# EAGLE design team4-selo-atmega32u4 (EAGLE 9.5.1)
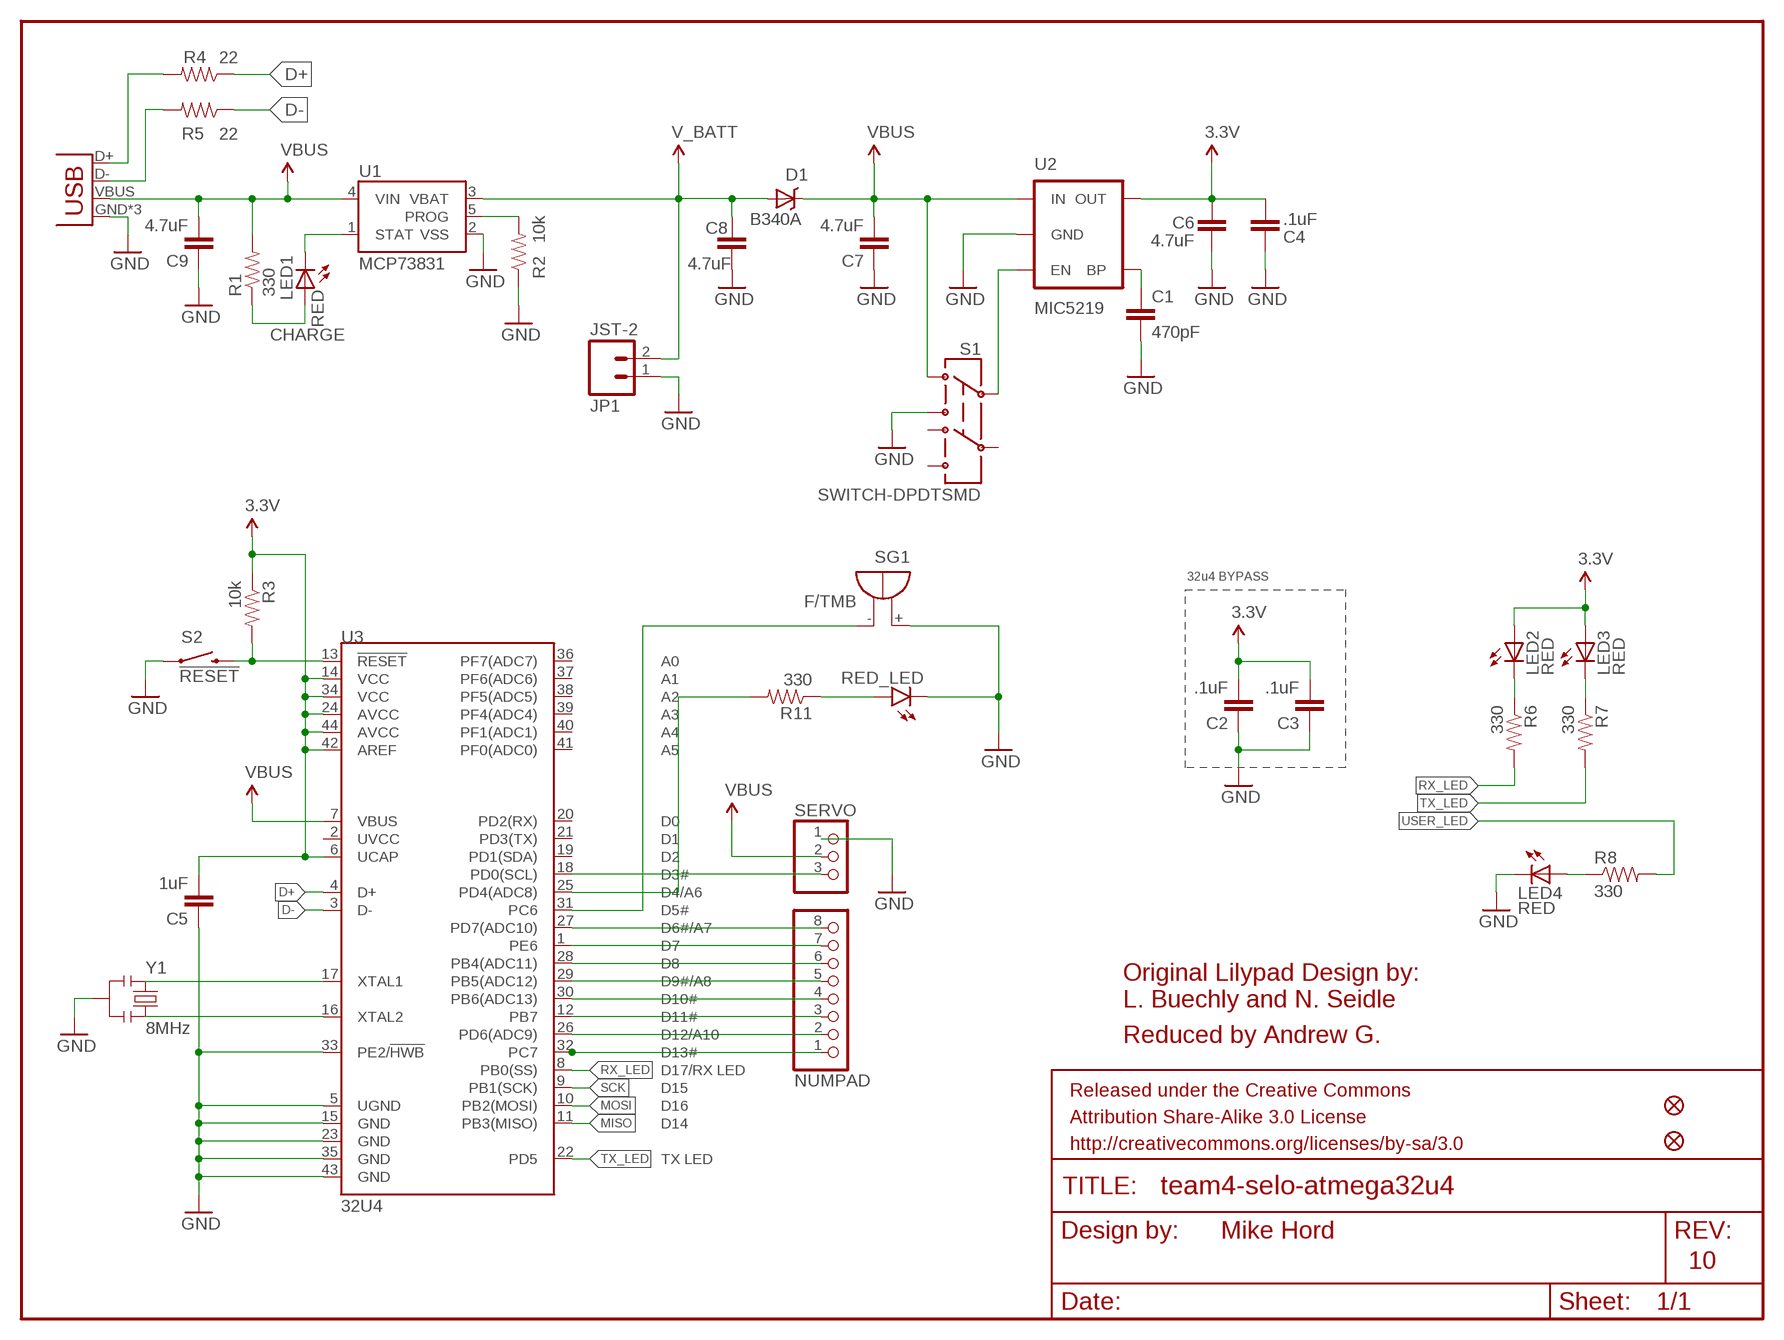
[diagram p0: schematic, sheet 1]

## Parts
C1  470pF  CAP0603-CAP  [0603-CAP]
C2  .1uF  CAP0603-CAP  [0603-CAP]
C3  .1uF  CAP0603-CAP  [0603-CAP]
C4  .1uF  CAP0603-CAP  [0603-CAP]
C5  1uF  CAP0603-CAP  [0603-CAP]
C6  4.7uF  CAP0603-CAP  [0603-CAP]
C7  4.7uF  CAP1206  [1206]
C8  4.7uF  CAP1206  [1206]
C9  4.7uF  CAP1206  [1206]
D1  B340A  DIODE-SCHOTTKY_  [SMA-DIODE]
JP1  JST-2  M02-JST-2MM-SMT  [JST-2-SMD]
JP2  FIDUCIALUFIDUCIAL  [MICRO-FIDUCIAL]
JP3  FIDUCIALUFIDUCIAL  [MICRO-FIDUCIAL]
LED1  RED  LED0603  [LED-0603]
LED2  RED  LED0603  [LED-0603]
LED3  RED  LED0603  [LED-0603]
LED4  RED  LED0603  [LED-0603]
NUMPAD  PINHD-1X8  [1X08]
R1  330  RESISTOR0603-RES  [0603-RES]
R2  10k  RESISTOR0603-RES  [0603-RES]
R3  10k  RESISTOR0603-RES  [0603-RES]
R4  22  RESISTOR0603-RES  [0603-RES]
R5  22  RESISTOR0603-RES  [0603-RES]
R6  330  RESISTOR0603-RES  [0603-RES]
R7  330  RESISTOR0603-RES  [0603-RES]
R8  330  RESISTOR0603-RES  [0603-RES]
R11  330  RESISTOR0603-RES  [0603-RES]
RED_LED  LED5MM  [LED5MM]
S1  SWITCH-DPDTSMD  [AYZ0202]
S2  !RESET  SWITCH-MOMENTARY-2SMD  [TACTILE_SWITCH_SMD]
SERVO  PINHD-1X3  [1X03]
SG1  F/TMB  [F/TMB]
U1  MCP73831  [SOT23-5]
U2  MIC5219  V_REG_MIC5219SMD  [SOT23-5]
U3  32U4  ATMEGA32U4TQFP-44  [TQFP44]
X1  USB-MICROB  [USB-MICROB]
Y1  8MHz  RESONATORSMD  [RESONATOR-SMD]

## Nets
3.3V: C2.2 C3.2 C4.2 C5.2 C6.2 LED2.A LED3.A R3.1 U2.5(OUT) U3.6(UCAP) U3.14(VCC) U3.24(AVCC) U3.34(VCC) U3.42(AREF) U3.44(AVCC)
5V: C7.2 C9.2 D1.C R1.2 S1.1 SERVO.2 U1.4(VIN) U2.1(IN) U3.7(VBUS) X1.VBUS ; supply symbol labelled VBUS
D+: R4.1 U3.4(D+)
D-: R5.1 U3.3(D-)
GND: C1.2 C2.1 C3.1 C4.1 C5.1 C6.1 C7.1 C8.1 C9.1 JP1.1 LED4.C R2.1 RED_LED.K(C) S1.3 S2.1 SERVO.1 SG1.+ U1.2(VSS) U2.2(GND) U3.5(UGND) U3.15(GND) U3.23(GND) U3.33(PE2/!HWB) U3.35(GND) U3.43(GND) X1.GND X1.MT1(GND) X1.MT2(GND) Y1.2
MISO: U3.11(PB3(MISO))
MOSI: U3.10(PB2(MOSI))
N$1: LED2.C R6.1
N$2: S1.2 U2.3(EN)
N$3: LED1.A R1.1
N$4: LED1.C U1.1(STAT)
N$5: U3.17(XTAL1) Y1.1
N$6: R2.2 U1.5(PROG)
N$7: U3.16(XTAL2) Y1.3
N$8: C1.1 U2.4(BP)
N$9: NUMPAD.8 U3.27(PD7(ADC10))
N$10: NUMPAD.7 U3.1(PE6)
N$11: NUMPAD.6 U3.28(PB4(ADC11))
N$12: NUMPAD.5 U3.29(PB5(ADC12))
N$13: NUMPAD.4 U3.30(PB6(ADC13))
N$14: NUMPAD.3 U3.12(PB7)
N$15: NUMPAD.2 U3.26(PD6(ADC9))
N$16: SERVO.3 U3.18(PD0(SCL))
N$17: SG1.- U3.31(PC6)
N$18: LED4.A R8.1
N$19: R5.2 X1.D-
N$20: R4.2 X1.D+
N$21: LED3.C R7.1
N$22: R11.2 U3.25(PD4(ADC8))
N$23: R11.1 RED_LED.A
RESET: R3.2 S2.3 U3.13(!RESET)
RX_LED: R6.2 U3.8(PB0(SS))
SCK: U3.9(PB1(SCK))
TX_LED: R7.2 U3.22(PD5)
USER_LED: NUMPAD.1 R8.2 U3.32(PC7)
V_BATT: C8.2 D1.A JP1.2 U1.3(VBAT)
Unconnected: S1.4 S1.5 S1.6 U3.2(UVCC) U3.19(PD1(SDA)) U3.20(PD2(RX)) U3.21(PD3(TX)) U3.36(PF7(ADC7)) U3.37(PF6(ADC6)) U3.38(PF5(ADC5)) U3.39(PF4(ADC4)) U3.40(PF1(ADC1)) U3.41(PF0(ADC0))

## Notes on the sheet
- CHARGE
- 32u4 BYPASS
- Original Lilypad Design by:
- L. Buechly and N. Seidle
- Reduced by Andrew G.
- Mike Hord
- 10

## Library data of the parts
C1 = SparkFun-Passives:CAP: Capacitor Standard 0603 ceramic capacitor, and 0.1" leaded capacitor.; PROD_ID: CAP-07884
C2-C4 = SparkFun-Passives:CAP: Capacitor Standard 0603 ceramic capacitor, and 0.1" leaded capacitor.; PROD_ID: CAP-00810
C5 = SparkFun-Passives:CAP: Capacitor Standard 0603 ceramic capacitor, and 0.1" leaded capacitor.; PROD_ID: CAP-00868
C6 = SparkFun-Passives:CAP: Capacitor Standard 0603 ceramic capacitor, and 0.1" leaded capacitor.; PROD_ID: CAP-08280
C7-C9 = SparkFun-Passives:CAP: Capacitor Standard 0603 ceramic capacitor, and 0.1" leaded capacitor.; PROD_ID: CAP-10300
D1 = SparkFun-DiscreteSemi:DIODE-SCHOTTKY: Commonly MBRA140.; PROD_ID: DIO-09886
JP1 = SparkFun-Connectors:M02: Header 2 Standard 2-pin 0.1" header. Use with straight break away headers (SKU : PRT-00116), right angle break away headers (PRT-00553), swiss pins (PRT-00743), machine pins (PRT-00117), and female headers (PRT-00115). Molex polarized connector foot print use with SKU : PRT-08233 with associated crimp pins and housings.; PROD_ID: CONN-08352
JP2 JP3 = SparkFun:FIDUCIAL: Fiducial Alignment Points Various fiducial points for machine vision alignment.
LED1-LED4 = SparkFun-LED:LED: LEDs Standard schematic elements and footprints for 5mm, 3mm, 1206, and 0603 sized LEDs. 5mm - Spark Fun Electronics SKU : COM-00529 (and others); PROD_ID: DIO-00819
NUMPAD = pinhead:PINHD-1X8: PIN HEADER
R1 R6-R8 R11 = SparkFun-Passives:RESISTOR: Resistor Basic schematic elements and footprints for 0603, 1206, and PTH resistors.; PROD_ID: RES-00818
R2 R3 = SparkFun-Passives:RESISTOR: Resistor Basic schematic elements and footprints for 0603, 1206, and PTH resistors.; PROD_ID: RES-00824
R4 R5 = SparkFun-Passives:RESISTOR: Resistor Basic schematic elements and footprints for 0603, 1206, and PTH resistors.; PROD_ID: RES-08698
RED_LED = led:LED: LED OSRAM: - CHIPLED LG R971, LG N971, LY N971, LG Q971, LY Q971, LO R971, LY R971 LH N974, LH R974 LS Q976, LO Q976, LY Q976 LO Q996 - Hyper CHIPLED LW Q18S LB Q993, LB Q99A, LB R99A - SideLED LS A670, LO A670, LY A670, LG A670, LP A670 LB A673, LV A673, LT A673, LW A673 LH A674 LY A675 LS A676, LA A676, LO A676, LY A676, LW A676 LS A679, LY A679, LG A679 - Hyper Micro SIDELED® LS Y876, LA Y876, LO Y876, LY Y876 LT Y87S - SmartLED LW L88C, LW L88S LB L89C, LB L89S, LG L890 LS L89K, LO L89K, LY L89K LS L896, LA L896, LO L896, LY L896 - TOPLED LS T670, LO T670, LY T670, LG T670, LP T670 LSG T670, LSP T670, LSY T670, LOP T670, LYG T670 LG T671, LOG T671, LSG T671 LB T673, LV T673, LT T673, LW T673 LH T674 LS T676, LA T676, LO T676, LY T676, LB T676, LH T676, LSB T676, LW T676 LB T67C, LV T67C, LT T67C, LS T67K, LO T67K, LY T67K, LW E67C LS E67B, LA E67B, LO E67B, LY E67B, LB E67C, LV E67C, LT E67C LW T67C LS T679, LY T679, LG T679 LS T770, LO T770, LY T770, LG T770, LP T770 LB T773, LV T773, LT T773, LW T773 LH T774 LS E675, LA E675, LY E675, LS T675 LS T776, LA T776, LO T776, LY T776, LB T776 LHGB T686 LT T68C, LB T68C - Hyper Mini TOPLED® LB M676 - Mini TOPLED Santana® LG M470 LS M47K, LO M47K, LY M47K Source: http://www.osram.convergy.de LUXEON: - LUMILED® LXK2-PW12-R00, LXK2-PW12-S00, LXK2-PW14-U00, LXK2-PW14-V00 LXK2-PM12-R00, LXK2-PM12-S00, LXK2-PM14-U00 LXK2-PE12-Q00, LXK2-PE12-R00, LXK2-PE12-S00, LXK2-PE14-T00, LXK2-PE14-U00 LXK2-PB12-K00, LXK2-PB12-L00, LXK2-PB12-M00, LXK2-PB14-N00, LXK2-PB14-P00, LXK2-PB14-Q00 LXK2-PR12-L00, LXK2-PR12-M00, LXK2-PR14-Q00, LXK2-PR14-R00 LXK2-PD12-Q00, LXK2-PD12-R00, LXK2-PD12-S00 LXK2-PH12-R00, LXK2-PH12-S00 LXK2-PL12-P00, LXK2-PL12-Q00, LXK2-PL12-R00 Source: www.luxeon.com KINGBRIGHT: KA-3528ASYC Source: www.kingbright.com
S1 = SparkFun-Electromechanical:SWITCH-DPDT: DPDT Version of the COM-00597; PROD_ID: SWCH-08179
S2 = SparkFun-Electromechanical:SWITCH-MOMENTARY-2: Various NO switches- pushbuttons, reed, etc; PROD_ID: SWCH-08247
SERVO = pinhead:PINHD-1X3: PIN HEADER
SG1 = buzzer:F/TMB: BUZZER Source: Buerklin; OC_FARNELL: unknown; OC_NEWARK: unknown
U1 = SparkFun-PowerIC:MCP73831: Miniature single cell, fully integrated Li-Ion, Li-polymer charge management controller http://ww1.microchip.com/downloads/en/DeviceDoc/21984a.pdf; PROD_ID: IC-09995
U2 = SparkFun-PowerIC:V_REG_MIC5219: V_REG MIC5219 Standard 500mA LDO voltage regulator in SOT-23 layout. Micrel part MIC5219. BP (by-pass) pin is used to lower output noise with 470pF cap, may be left open.; PROD_ID: VREG-09872
U3 = SparkFun-IC-Microcontroller:ATMEGA32U4: Atmel MCU, 32KByte Atmel 44-pin 8-bit Microcontroller with 32KBytes of ISP Flash and USB Controller Datasheet <http://cdn.sparkfun.com/datasheets/Dev/Arduino/Boards/ATMega32U4.pdf> SparkFun Products LilyPad Arduino USB - ATmega32U4 Board <https://www.sparkfun.com/products/12049> (DEV-12049) Pro Micro - 5V/16MHz <https://www.sparkfun.com/products/12640> (DEV-12640) Pro Micro - 3.3V/8MHz <https://www.sparkfun.com/products/12587> (DEV-12587) Fio v3 - ATmega32U4 <https://www.sparkfun.com/products/11520> (DEV-11520) Qduino Mini <https://www.sparkfun.com/products/13614> (DEV-13614) Makey Makey - Standard Kit <https://www.sparkfun.com/products/11511> (WIG-11511) Makey Makey Deluxe Kit <https://www.sparkfun.com/products/11519> (WIG-11519); PROD_ID: IC-10828
X1 = SparkFun-Connectors:USB: USB Connectors USB-B-PTH is fully proven SKU : PRT-00139 USB-miniB is fully proven SKU : PRT-00587 USB-A-PCB is untested. USB-A-H is throughly reviewed, but untested. Spark Fun Electronics SKU : PRT-00437 USB-B-SMT is throughly reviewed, but untested. Needs silkscreen touching up. USB-A-S has not been used/tested USB-MB-H has not been used/tested; PROD_ID: CONN-09505
Y1 = SparkFun-FreqCtrl:RESONATOR: Resonator Small SMD resonator. This is the itty bitty 10/20MHz resonators with built in caps. CSTCE10M0G55 and CSTCE20M0V53. Footprint has been reviewed closely but hasn't been tested yet.; PROD_ID: XTAL-08895

## Board
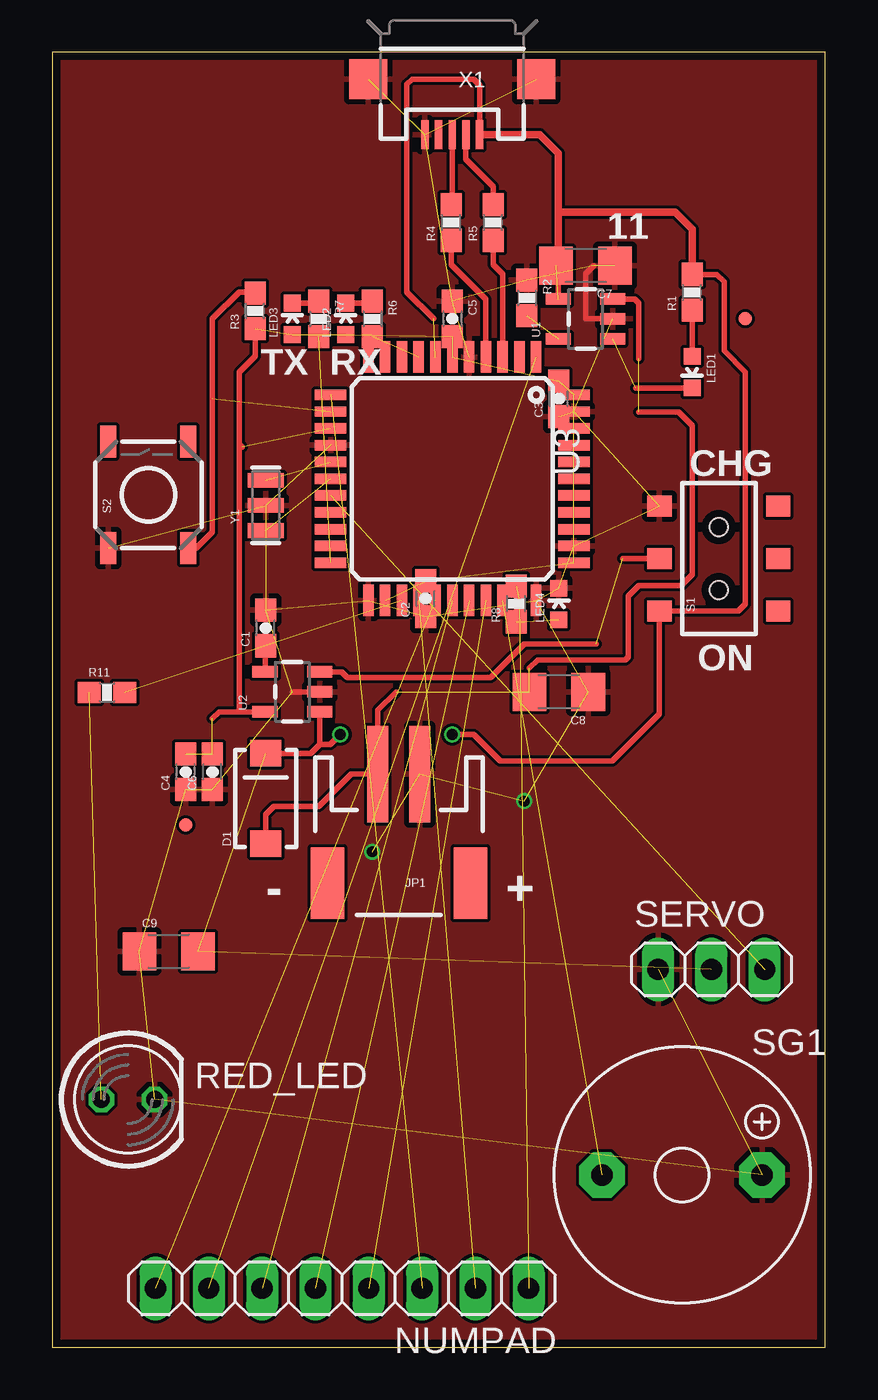
[diagram p1: board, top side]
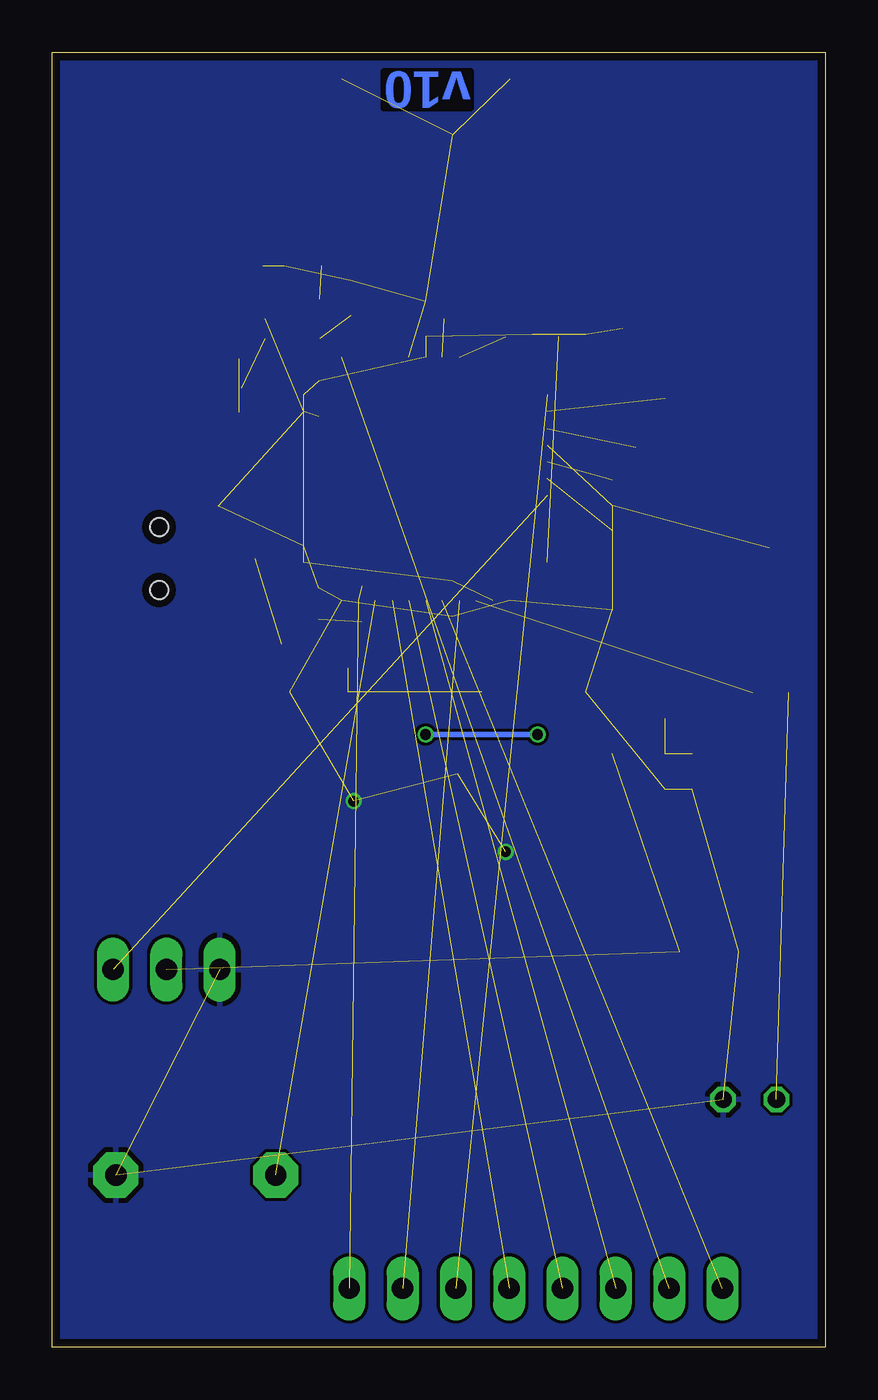
[diagram p2: board, bottom side, seen from below]

Size 36.83 x 61.71 mm. Coordinates in mm from the lower left corner, seen from the top.
Outline: 0,0 36.83,0 36.83,61.71 0,61.71 0,0
Copper layers (1*16): Top 0.035559375mm / dielectric 1.6mm / Bottom 0.035559375mm
Design rules "oshpark-2layer": minimum track width 6mil, minimum drill 10mil, track to track 6mil, track to pad 6mil, pad to pad 6mil, via to via 6mil, smd to smd 6mil, copper to edge 15mil, drill to drill 6mil, minimum pad ring 5mil, minimum via ring 5mil, stop-mask expansion 2.5mil, vias tented up to drill 0mil, thermal gap 10mil

### Footprints (pad centres in the part's own frame; a part is rotated, then mirrored left to right if it is on the bottom)
0603-CAP = smd 1.1 x 1: 1 -0.85,0; 2 0.85,0
1206 = smd 1.6 x 1.8: 1 -1.4,0; 2 1.4,0
SMA-DIODE = smd 1.27 x 1.47: A -2.15,0; C 2.15,0
JST-2-SMD = smd 1 x 4.6: 1 -1,-3.7; 2 1,-3.7 | smd 1.6 x 3.4: NC1 -3.4,1.5; NC2 3.4,1.5
MICRO-FIDUCIAL = smd 0.635 x 0.635: 1 0,0
LED-0603 = smd 0.8 x 0.8: A 0,-0.75; C 0,0.75
1X08 = drill 1.016 long: 1 -8.89,0; 2 -6.35,0; 3 -3.81,0; 4 -1.27,0; 5 1.27,0; 6 3.81,0; 7 6.35,0; 8 8.89,0
0603-RES = smd 1.1 x 1: 1 -0.85,0; 2 0.85,0
LED5MM = drill 0.813 octagon: A -1.27,0; K 1.27,0
AYZ0202 = smd 1 x 1.15: 1 -2.5,2.825; 2 0,2.825; 3 2.5,2.825; 4 -2.5,-2.825; 5 0,-2.825; 6 2.5,-2.825 | hole 0.85: 1.5,0; -1.5,0
TACTILE_SWITCH_SMD = smd 1.524 x 0.762: 1 -2.54,1.905; 2 2.54,1.905; 3 -2.54,-1.905; 4 2.54,-1.905
1X03 = drill 1.016 long: 1 -2.54,0; 2 0,0; 3 2.54,0
F/TMB = drill 1.016 pad 2.159 octagon: + 3.81,0; - -3.81,0
SOT23-5 = smd 0.55 x 1.2: 1 -0.95,-1.3; 2 0,-1.3; 3 0.95,-1.3; 4 0.95,1.3; 5 -0.95,1.3
TQFP44 = smd 1.5 x 0.5: 1 -5.8,4; 2 -5.8,3.2; 3 -5.8,2.4; 4 -5.8,1.6; 5 -5.8,0.8; 6 -5.8,0; 7 -5.8,-0.8; 8 -5.8,-1.6; 9 -5.8,-2.4; 10 -5.8,-3.2; 11 -5.8,-4; 23 5.8,-4; 24 5.8,-3.2; 25 5.8,-2.4; 26 5.8,-1.6; 27 5.8,-0.8; 28 5.8,0; 29 5.8,0.8; 30 5.8,1.6; 31 5.8,2.4; 32 5.8,3.2; 33 5.8,4 | smd 0.5 x 1.5: 12 -4,-5.8; 13 -3.2,-5.8; 14 -2.4,-5.8; 15 -1.6,-5.8; 16 -0.8,-5.8; 17 0,-5.8; 18 0.8,-5.8; 19 1.6,-5.8; 20 2.4,-5.8; 21 3.2,-5.8; 22 4,-5.8; 34 4,5.8; 35 3.2,5.8; 36 2.4,5.8; 37 1.6,5.8; 38 0.8,5.8; 39 0,5.8; 40 -0.8,5.8; 41 -1.6,5.8; 42 -2.4,5.8; 43 -3.2,5.8; 44 -4,5.8
USB-MICROB = smd 0.35 x 1.4: D+ 0,2.65; D- -0.65,2.65; GND 1.3,2.65; ID 0.65,2.65; VBUS -1.3,2.65 | smd 1.8 x 1.9: MT1 -4,0; MT2 4,0
RESONATOR-SMD = smd 0.7 x 1.7: 1 -1.2,0; 2 0,0; 3 1.2,0

### Placement (x,y rotation side)
C1  10.16,34.28 90 top
C2  17.78,35.68 90 top
C3  24.13,45.2 90 top
C4  6.35,27.42 90 top
C5  19.05,49.01 270 top
C6  7.62,27.42 90 top
C7  25.4,51.55 180 top
C8  24.13,31.23 180 top
C9  5.54,18.86 0 top
D1  10.16,26.15 90 top
JP1  16.51,23.61 180 top
JP2  6.35,24.88 0 top
JP3  33.02,49.01 0 top
LED1  30.48,46.47 180 top
LED2  13.97,49.01 0 top
LED3  11.43,49.01 0 top
LED4  24.13,35.42 0 top
NUMPAD  13.8,2.8 180 top
R1  30.48,50.28 90 top
R2  22.61,50.01 270 top
R3  9.65,49.39 90 top
R4  19,53.6 90 top
R5  21,53.6 90 top
R6  15.24,49.01 270 top
R7  12.7,49.01 270 top
R8  22.1,35.42 90 top
R11  2.6,31.2 0 top
RED_LED  3.6,11.8 0 top
S1  31.75,37.58 90 top
S2  4.57,40.63 90 top
SERVO  31.4,18 0 top
SG1  30,8.2 0 top
U1  25.4,49.01 90 top
U2  11.43,31.23 90 top
U3  19.05,41.39 270 top
X1  19.05,60.44 180 top
Y1  10.16,40.12 90 top

### Tracks (layer width: path | path; a pad name or v marks a point on that pad's centre or on a via)
3.3V  (13 unrouted)
  Top 0.254: 9.84,30.28 U2.5 8.95,30.28 | 8.95,30.28 8.89,30.34 8.89,43.04 | 8.95,30.28 7.94,30.28 7.62,29.96 | R3.1 9.65,47.23 8.89,46.47 8.89,43.04 | 9.04,42.89 8.89,43.04
5V  (via drill 0.51)  (4 unrouted)
  Top 0.254: U1.4 24.1,51.45 | X1.VBUS 20.35,60.16 20.07,60.44 17.14,60.44 16.89,60.19 16.89,50.28 18.16,49.01 | D1.C 12.31,28.3 12.73,28.72 | U2.1 12.73,28.72 | R1.2 31.66,51.13 32,50.79 32,47.49 33.02,46.47 33.02,35.42 32.68,35.08 S1.1 28.93,30.18 26.67,27.93 21.34,27.93 20.07,29.2 v19.05,29.2 | 12.73,28.72 13.24,28.72 v13.72,29.2
  Top 0.35: R1.2 30.48,53.3 29.69,54.09 24.1,54.09 | X1.VBUS 23.22,57.79 24.1,56.91 24.1,54.09 | 24.1,51.45 24.1,54.09
  Bottom 0.254: v13.72,29.2 v19.05,29.2
D+
  Top 0.254: R4.1 19,51.6 20.65,49.95 U3.4
D-
  Top 0.254: R5.1 21,51.59 21.45,51.14 U3.3
GND  (via drill 0.51)  (30 unrouted)
  Top 0.254: U1.2 25.4,49.01 25.4,51.17 25.78,51.55 | U2.2 11.43,31.23
  other vias: 15.24,23.61 22.48,26.02
  pour Top: 0,0 36.83,0 36.83,61.71 0,61.71
  pour Bottom: 0,0 36.83,0 36.83,61.71 0,61.71
N$1
  Top 0.254: LED2.C 15.14,49.76 R6.1
N$2  (1 unrouted)
  Top 0.254: 27.18,37.58 S1.2 | 25.91,33.52 22.48,33.52 20.89,31.93 14.04,31.93 13.78,32.18 U2.3
N$3
  Top 0.254: R1.1 LED1.A
N$4  (1 unrouted)
  Top 0.254: LED1.C 27.8,45.72
N$5  (1 unrouted)
N$6  (1 unrouted)
N$7  (1 unrouted)
N$8
  Top 0.254: U2.4 10.13,34.16 C1.1
N$9  (1 unrouted)
N$10  (1 unrouted)
N$11  (1 unrouted)
N$12  (1 unrouted)
N$13  (1 unrouted)
N$14  (1 unrouted)
N$15  (1 unrouted)
N$16  (1 unrouted)
N$17  (1 unrouted)
N$18  (1 unrouted)
N$19
  Top 0.254: X1.D- 19.7,56.61 21,55.31 R5.2
N$20
  Top 0.254: X1.D+ 19.05,54.5 R4.2
N$21
  Top 0.254: LED3.C 12.6,49.76 R7.1
N$22  (1 unrouted)
N$23  (1 unrouted)
RESET  (1 unrouted)
  Top 0.254: R3.2 9.61,50.28 8.89,50.28 7.62,49.01 7.62,45.2 7.62,38.85 6.86,38.09 S2.3
RX_LED  (1 unrouted)
TX_LED  (1 unrouted)
USER_LED  (2 unrouted)
V_BATT  (3 unrouted)
  Top 0.254: U1.3 27.75,49.96 27.94,49.77 27.94,47.11 | 16.38,31.23 15.51,30.36 JP1.2 14.24,27.31 12.7,25.77 10.54,25.77 10.16,25.39 D1.A | 27.94,44.56 29.84,44.56 30.48,43.93 30.48,36.82 29.97,36.31 27.94,36.31 27.43,35.8 27.43,32.88 27.3,32.75 23.11,32.75 22.73,32.37

### Text on the board
Bottom: v10
tPlace: 11 | TX | RX | CHG | ON | - | +